# EAGLE design MoodBadge (EAGLE 9.2.2)
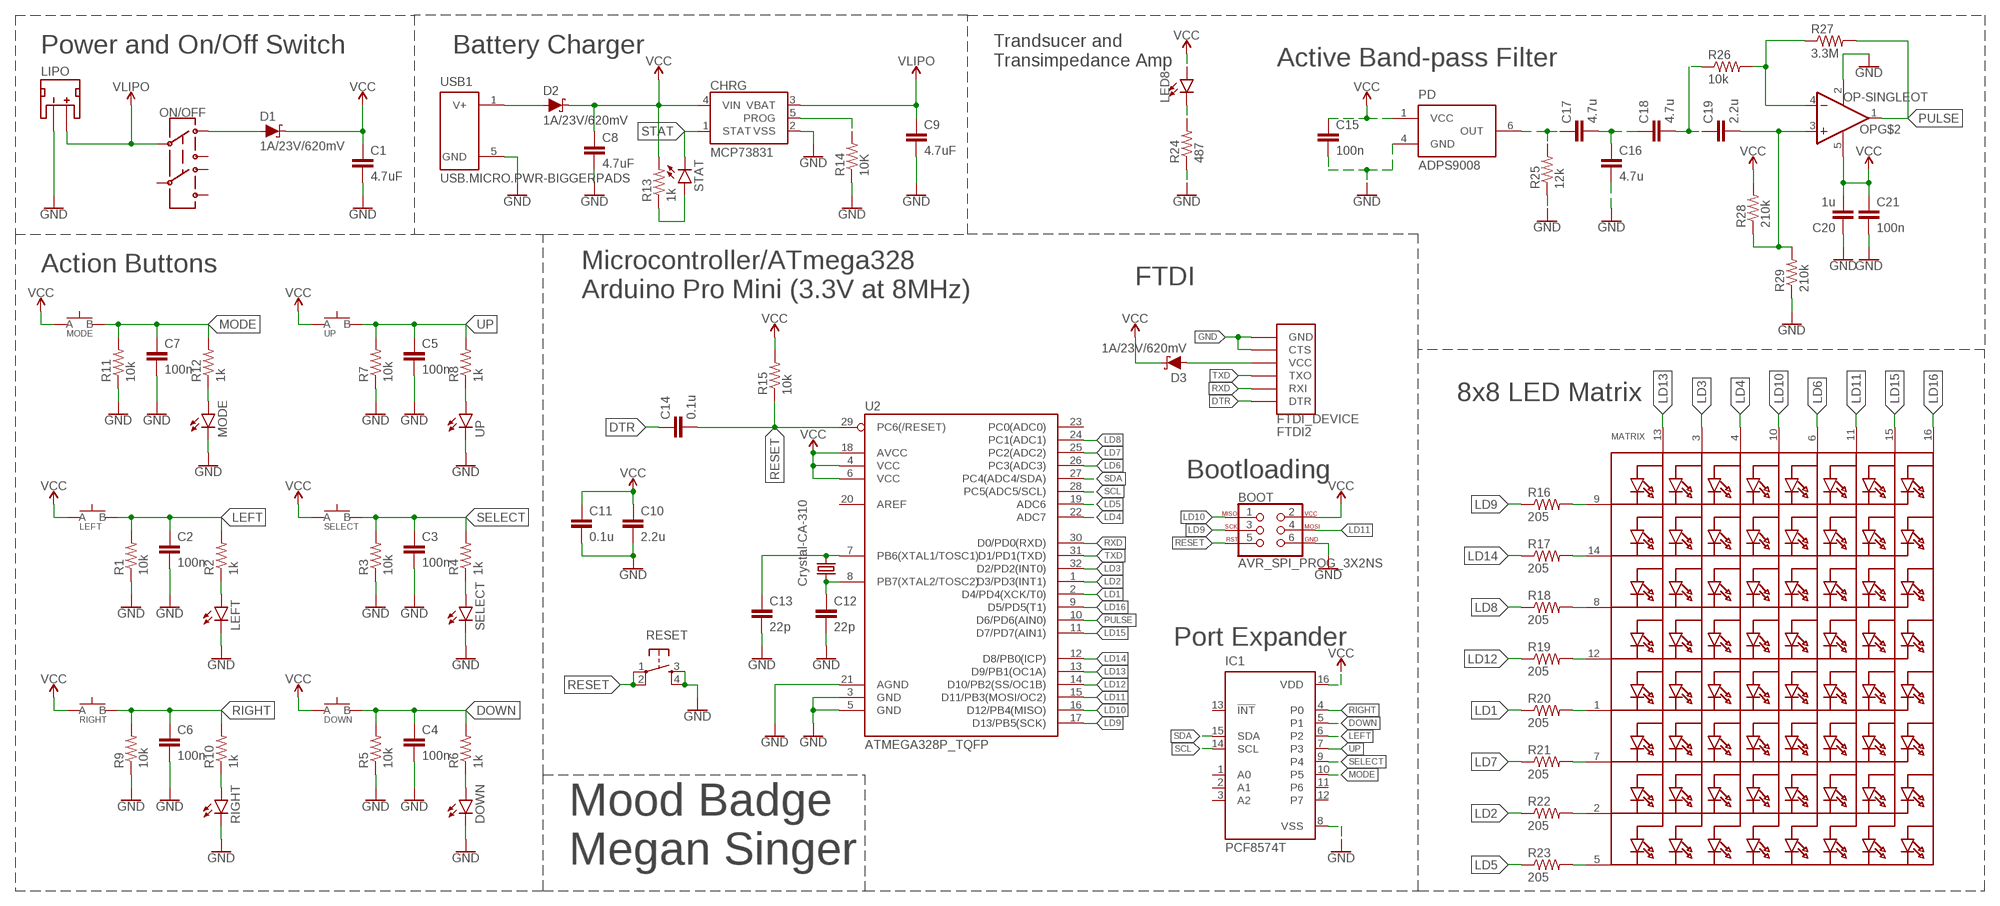
[diagram p0: schematic, sheet 1]

## Parts
BOOT  AVR_SPI_PROG_3X2NS  [2X3-NS]
C1  4.7uF  4.7UF-0603-6.3V-(10%)  [0603]
C2  100n  CAPACITOR0603  [C0603]
C3  100n  CAPACITOR0603  [C0603]
C4  100n  CAPACITOR0603  [C0603]
C5  100n  CAPACITOR0603  [C0603]
C6  100n  CAPACITOR0603  [C0603]
C7  100n  CAPACITOR0603  [C0603]
C8  4.7uF  4.7UF-0603-6.3V-(10%)  [0603]
C9  4.7uF  4.7UF-0603-6.3V-(10%)  [0603]
C10  2.2u  CAPACITOR0603  [C0603]
C11  0.1u  CAPACITOR0603  [C0603]
C12  22p  CAPACITOR0603  [C0603]
C13  22p  CAPACITOR0603  [C0603]
C14  0.1u  CAPACITOR0603  [C0603]
C15  100n  4.7UF-0603-6.3V-(10%)  [0603]
C16  4.7u  4.7UF-0603-6.3V-(10%)  [0603]
C17  4.7u  4.7UF-0603-6.3V-(10%)  [0603]
C18  4.7u  4.7UF-0603-6.3V-(10%)  [0603]
C19  2.2u  4.7UF-0603-6.3V-(10%)  [0603]
C20  1u  4.7UF-0603-6.3V-(10%)  [0603]
C21  100n  4.7UF-0603-6.3V-(10%)  [0603]
CHRG  MCP73831  [SOT23-5]
D1  1A/23V/620mV  SCHOTTKY-USC  [USC]
D2  1A/23V/620mV  SCHOTTKY-USC  [USC]
D3  1A/23V/620mV  SCHOTTKY-USC  [USC]
DOWN  SPST.KT11P4SM34LFS  [SPST.KT11P4SM34LFS]
FTDI2  FTDI_DEVICE  [FTDI_DEVICE]
IC1  PCF8574T  [SO16W]
LED1  LEFT  LED0603  [LED-0603]
LED2  SELECT  LED0603  [LED-0603]
LED3  DOWN  LED0603  [LED-0603]
LED4  UP  LED0603  [LED-0603]
LED5  RIGHT  LED0603  [LED-0603]
LED6  MODE  LED0603  [LED-0603]
LED7  STAT  LED0603  [LED-0603]
LED8  LEDZ-BEND  [2-SMD.Z-BEND]
LEFT  SPST.KT11P4SM34LFS  [SPST.KT11P4SM34LFS]
LIPO  JST_2MM_MALE  [JST-2-SMD]
MATRIX  SEGMENT_8X8_ROWCATHODEBL-M12A883  [SEGMENT_BL-M12A883]
MODE  SPST.KT11P4SM34LFS  [SPST.KT11P4SM34LFS]
ON/OFF  SWITCH.JS202011JXQNUPWARDS  [SWITCH.00]
OP  OP-SINGLEOT  [SOT23-5]
PD  ADPS9008  [6-PIN.CHIPLED]
R1  10k  RESISTOR0603  [R0603]
R2  1k  RESISTOR0603  [R0603]
R3  10k  RESISTOR0603  [R0603]
R4  1k  RESISTOR0603  [R0603]
R5  10k  RESISTOR0603  [R0603]
R6  1k  RESISTOR0603  [R0603]
R7  10k  RESISTOR0603  [R0603]
R8  1k  RESISTOR0603  [R0603]
R9  10k  RESISTOR0603  [R0603]
R10  1k  RESISTOR0603  [R0603]
R11  10k  RESISTOR0603  [R0603]
R12  1k  RESISTOR0603  [R0603]
R13  1k  RESISTOR0603  [R0603]
R14  10K  RESISTOR0603  [R0603]
R15  10k  RESISTOR0603  [R0603]
R16  205  RESISTOR0603  [R0603]
R17  205  RESISTOR0603  [R0603]
R18  205  RESISTOR0603  [R0603]
R19  205  RESISTOR0603  [R0603]
R20  205  RESISTOR0603  [R0603]
R21  205  RESISTOR0603  [R0603]
R22  205  RESISTOR0603  [R0603]
R23  205  RESISTOR0603  [R0603]
R24  487  RESISTOR0603  [R0603]
R25  12k  RESISTOR0603  [R0603]
R26  10k  RESISTOR0603  [R0603]
R27  3.3M  RESISTOR0603  [R0603]
R28  210k  RESISTOR0603  [R0603]
R29  210k  RESISTOR0603  [R0603]
RESET  SPST-PTS830GG140  [BUTTON-GULLWING]
RIGHT  SPST.KT11P4SM34LFS  [SPST.KT11P4SM34LFS]
SELECT  SPST.KT11P4SM34LFS  [SPST.KT11P4SM34LFS]
U2  ATMEGA328P_TQFP  [TQFP32-08]
UP  SPST.KT11P4SM34LFS  [SPST.KT11P4SM34LFS]
USB1  USB.MICRO.PWR-BIGGERPADS  [USB-MICRO-01.BIGGERPADS.PWR]
Y1  Crystal-CA-310  CRYSTAL-CA-310  [CA-301]

## Nets
DOWN: C4.1 DOWN.3(B) DOWN.4(B) IC1.5(P1) R5.2 R6.2
DTR: C14.1 FTDI2.DTR
GND [power]: BOOT.6 C1.2 C2.2 C3.2 C4.2 C5.2 C6.2 C7.2 C8.2 C9.2 C10.2 C11.2 C12.2 C13.2 C15.2 C16.2 C20.1 C21.2 CHRG.2(VSS) FTDI2.CTS FTDI2.GND IC1.8(VSS) LED1.C LED2.C LED3.C LED4.C LED5.C LED6.C LIPO.1(-) OP.2(V-) PD.4(GND) R1.1 R3.1 R5.1 R7.1 R9.1 R11.1 R14.1 R24.1 R25.1 R29.1 RESET.3 RESET.4 U2.3(GND) U2.5(GND) U2.21(AGND) USB1.5(GND)
LD1: R20.1 U2.2(D4/PD4(XCK/T0))
LD2: R22.1 U2.1(D3/PD3(INT1))
LD3: MATRIX.3(A2) U2.32(D2/PD2(INT0))
LD4: MATRIX.4(A3) U2.22(ADC7)
LD5: R23.1 U2.19(ADC6)
LD6: MATRIX.6(A5) U2.26(PC3(ADC3))
LD7: R21.1 U2.25(PC2(ADC2))
LD8: R18.1 U2.24(PC1(ADC1))
LD9: BOOT.3 R16.1 U2.17(D13/PB5(SCK))
LD10: BOOT.1 MATRIX.10(A4) U2.16(D12/PB4(MISO))
LD11: BOOT.4 MATRIX.11(A6) U2.15(D11/PB3(MOSI/OC2))
LD12: R19.1 U2.14(D10/PB2(SS/OC1B))
LD13: MATRIX.13(A1) U2.13(D9/PB1(OC1A))
LD14: R17.1 U2.12(D8/PB0(ICP))
LD15: MATRIX.15(A7) U2.11(D7/PD7(AIN1))
LD16: MATRIX.16(A8) U2.9(D5/PD5(T1))
LEFT: C2.1 IC1.6(P2) LEFT.3(B) LEFT.4(B) R1.2 R2.2
MODE: C7.1 IC1.10(P5) MODE.3(B) MODE.4(B) R11.2 R12.2
N$1 [power]: D2.+(A) USB1.1(V+)
N$2 [power]: D1.+(A) ON/OFF.1
N$3: LED1.A R2.1
N$4: CHRG.5(PROG) R14.2
N$5: LED2.A R4.1
N$6 [power]: LED7.A R13.1
N$7: LED3.A R6.1
N$8: C13.1 U2.7(PB6(XTAL1/TOSC1)) Y1.2
N$9: LED4.A R8.1
N$10: C12.1 U2.8(PB7(XTAL2/TOSC2)) Y1.1
N$11: LED5.A R10.1
N$12 [power]: D3.+(A) FTDI2.VCC
N$13: LED6.A R12.1
N$14: MATRIX.9(K1) R16.2
N$15: MATRIX.14(K2) R17.2
N$16: MATRIX.8(K3) R18.2
N$17: MATRIX.12(K4) R19.2
N$18: MATRIX.1(K5) R20.2
N$19: MATRIX.7(K6) R21.2
N$20: MATRIX.2(K7) R22.2
N$21: MATRIX.5(K8) R23.2
N$22: LED8.-(C) R24.2
N$23: C17.1 PD.6(OUT) R25.2
N$24: C16.1 C17.2 C18.1
N$25: C19.2 OP.3(+IN) R28.1 R29.2
N$26: C18.2 C19.1 R26.1
N$28: OP.4(-IN) R26.2 R27.1
PULSE: OP.1(OUT) R27.2 U2.10(D6/PD6(AIN0))
RESET: BOOT.5 C14.2 R15.1 RESET.1 RESET.2 U2.29(PC6(/RESET))
RIGHT: C6.1 IC1.4(P0) R9.2 R10.2 RIGHT.3(B) RIGHT.4(B)
RXD: FTDI2.TXO(RXI) U2.30(D0/PD0(RXD))
SCL: IC1.14(SCL) U2.28(PC5(ADC5/SCL))
SDA: IC1.15(SDA) U2.27(PC4(ADC4/SDA))
SELECT: C3.1 IC1.9(P4) R3.2 R4.2 SELECT.3(B) SELECT.4(B)
STAT: CHRG.1(STAT) LED7.C
TXD: FTDI2.RXI(TXO) U2.31(D1/PD1(TXD))
UP: C5.1 IC1.7(P3) R7.2 R8.2 UP.3(B) UP.4(B)
VCC [power]: BOOT.2 C8.1 C10.1 C11.1 C15.1 C20.2 C21.1 CHRG.4(VIN) D2.-(C) D3.-(C) DOWN.1(A) DOWN.2(A) IC1.16(VDD) LED8.+(A) LEFT.1(A) LEFT.2(A) MODE.1(A) MODE.2(A) OP.5(V+) PD.1(VCC) R13.2 R15.2 R28.2 RIGHT.1(A) RIGHT.2(A) SELECT.1(A) SELECT.2(A) U2.4(VCC) U2.6(VCC) U2.18(AVCC) UP.1(A) UP.2(A)
VLIPO [power]: C1.1 C9.1 CHRG.3(VBAT) D1.-(C) LIPO.2(+) ON/OFF.2 ; supply symbol labelled VCC
Unconnected: IC1.1(A0) IC1.2(A1) IC1.3(A2) IC1.11(P6) IC1.12(P7) IC1.13(!INT) LIPO.NC1(PAD1) LIPO.NC2(PAD2) ON/OFF.3 ON/OFF.5 ON/OFF.6 ON/OFF.7 U2.20(AREF) U2.23(PC0(ADC0))

## Notes on the sheet
- Power and On/Off Switch | Battery Charger
- Trandsucer and 
  Transimpedance Amp
- Active Band-pass Filter
- Action Buttons
- FTDI
- Microcontroller/ATmega328
  Arduino Pro Mini (3.3V at 8MHz)
- 8x8 LED Matrix
- Bootloading
- Port Expander
- Mood Badge
  Megan Singer

## Library data of the parts
BOOT = LinnesLab-Connectors:AVR_SPI_PROG_3X2: AVR ISP 6 Pin This is the reduced ISP connector for AVR programming. Common on Arduino. This footprint will take up less PCB space and can be used with a 10-pin to 6-pin adapter such as SKU: BOB-08508 **Special note about "TEST_POINT" package. The stop mask is on the top side, so if you want your programming test points to be on the bottom of your board, make sure to place this package on the bottom side of the board. This also ensure that the orientation to program from the bottom side will be correct. SparkFun Products: SparkFun ISP Pogo Adapter <https://www.sparkfun.com/products/11591> - NS Tiny AVR Programmer <https://www.sparkfun.com/products/11801> -PTH
C1 C8 C9 = SparkFun-Capacitors:4.7UF: 4.7µF ceramic capacitors A capacitor is a passive two-terminal electrical component used to store electrical energy temporarily in an electric field.; PROD_ID: CAP-08280
C2-C7 C10-C14 = LinnesLab-Passives:CAPACITOR
C15-C21 = SparkFun-Capacitors:4.7UF: 4.7µF ceramic capacitors A capacitor is a passive two-terminal electrical component used to store electrical energy temporarily in an electric field.; PROD_ID: CAP-08280; VALUE: 4.7uF
CHRG = SparkFun-IC-Power:MCP73831: MCP73831T Li-Ion, Li-Pol Controller Miniature single cell, fully integrated Li-Ion, Li-polymer charge management controller Datasheet <http://ww1.microchip.com/downloads/en/DeviceDoc/20001984g.pdf> SparkFun Products: SparkFun ESP32 Thing <https://www.sparkfun.com/products/13907> SparkFun 9DoF Razor IMU M0 <https://www.sparkfun.com/products/14001>; PROD_ID: IC-09995
D1-D3 = LinnesLab-DiscreteSemi:SCHOTTKY: Schottky diode A Schottky diode is a semiconductor diode which has a low forward voltage drop and a very fast switching action. Example: Digi-Key Part Number: RB161MM-20CT-ND
DOWN LEFT MODE RIGHT SELECT UP = LinnesLab-Switches:SPST.KT11P4SM34LFS: https://www.ckswitches.com/media/1468/kt.pdf
FTDI2 = LinnesLab-Connectors:FTDI_DEVICE
IC1 = micro-philips:PCF8574: I2C-Bus Remote 8-bit I/O expander http://www.semiconductors.philips.com/acrobat_download/datasheets/PCF8574_4.pdf; MPN: PCF8574T/3,512; OC_FARNELL: 1201255; OC_NEWARK: 70R6870
LED1-LED8 = LinnesLab-LED:LED: LED (Generic) Standard schematic elements and footprints for 5mm, 3mm, 1206, and 0603 sized LEDs. Generic LEDs with no color specified. LTST-C190KGKT: arrow indicates cathode
LIPO = LinnesLab-Connectors:JST_2MM_MALE: JST 2MM MALE RA CONNECTOR Two pin, compact surface mount connector. Commonly used as a battery input connection point. We really like the solid locking feeling and high current rating on these small connectors. We use these all the time as battery connectors. Mates to single-cell LiPo batteries. Here is the connector we sell at SparkFun: JST Right Angle Connector - White <https://www.sparkfun.com/products/8612> (PRT-08612) Datasheet <http://www.sparkfun.com/datasheets/Prototyping/Connectors/JST-Horizontal.pdf> It was used on these SparkFun products: SparkFun MOSFET Power Controller <https://www.sparkfun.com/products/11214> (PRT-11214) SparkFun Battery Babysitter - LiPo Battery Manager <https://www.sparkfun.com/products/13777> (PRT-13777) And many, many others that required a lipo battery connection.; PROD_ID: CONN-11443; SF_ID: PRT-08612
MATRIX = adafruit:SEGMENT_8X8_ROWCATHODE: 8x8 LED Segment Displays: Row = Cathode 0.7" Red 8X8 Matrix, 1.9mm Round LEDs - BL-M07C881UR 1.2" Red 8x8 Matrix, 3.0mm Round LEDs - BL-M12A881UR 1.2" Red 8x8 Matrix, 3.0mm Square LEDs - BL-M12A883
ON/OFF = LinnesLab-Switches:SWITCH.JS202011JXQN: Manufacturer's Part Numer: JS202011JAQN for right angle throw JS202011JCQN for top side throw
OP = LinnesLab-AnalogIC:OP-SINGLE: Single Op Amp 2.7V to 6.0V Single Supply CMOS Source: http://ww1.microchip.com/downloads/en/DeviceDoc/21314g.pdf
PD = LinnesLab-Sensors:ADPS9008
R1-R29 = LinnesLab-Passives:RESISTOR
RESET = LinnesLab-Switches:SPST-PTS830GG140
U2 = LinnesLab-Microcontrollers:ATMEGA328P_TQFP: Popular 328P in QFP Storefront component: ATmega328 - TQFP <https://www.sparkfun.com/products/13448> (COM-13448) Datasheet <http://www.sparkfun.com/datasheets/Components/SMD/ATMega328.pdf> SparkFun Products SparkFun RedBoard - Programmed with Arduino <https://www.sparkfun.com/products/12757> (DEV-12757) Arduino Pro Mini 328 - 5V/16MHz <https://www.sparkfun.com/products/11113> (DEV-11113) Arduino Pro Mini 328 - 3.3V/8MHz <https://www.sparkfun.com/products/11114> (DEV-11114) SparkFun OpenLog <https://www.sparkfun.com/products/13712> (DEV-13712) SparkFun MicroView - OLED Arduino Module <https://www.sparkfun.com/products/12923> (DEV-12923) SparkFun Digital Sandbox <https://www.sparkfun.com/products/12651> (DEV-12651) SparkFun PicoBoard <https://www.sparkfun.com/products/11888> (WIG-11888) Arduino Fio <https://www.sparkfun.com/products/10116> (DEV-10116) LilyPad Arduino 328 Main Board <https://www.sparkfun.com/products/13342> (DEV-13342) SparkFun RedStick <https://www.sparkfun.com/products/13741> (DEV-13741) LilyPad MP3 <https://www.sparkfun.com/products/11013> (DEV-11013) LilyPad Arduino SimpleSnap <https://www.sparkfun.com/products/10941> (DEV-10941) SparkFun Stepoko <https://www.sparkfun.com/products/13899> (ROB-13899) SparkFun Geiger Counter <https://www.sparkfun.com/products/11345> (SEN-11345) SparkFun EL Sequencer <https://www.sparkfun.com/products/12781> (COM-12781) Arduino Pro 328 - 5V/16MHz <https://www.sparkfun.com/products/10915> (DEV-10915) CryptoCape <https://www.sparkfun.com/products/12773> (DEV-12773) SparkFun IR Thermometer Evaluation Board - MLX90614 <https://www.sparkfun.com/products/10740> (SEN-10740) SparkFun RedBot Mainboard <https://www.sparkfun.com/products/12097> (ROB-12097) Arduino Pro 328 - 3.3V/8MHz <https://www.sparkfun.com/products/10914> (DEV-10914) SparkFun Block for Intel® Edison - Arduino <https://www.sparkfun.com/products/13036> (DEV-13036) SparkFun Simon Says - Surface Mount Soldering Kit <https://www.sparkfun.com/products/10935> (KIT-10935) SparkFun 7-Segment Serial Display - Red <https://www.sparkfun.com/products/11441> (COM-11441) SparkFun 7-Segment Serial Display - White <https://www.sparkfun.com/products/11629> (COM-11629) SparkFun 7-Segment Serial Display - Yellow <https://www.sparkfun.com/products/11443> (COM-11443) SparkFun 7-Segment Serial Display - Kelly Green <https://www.sparkfun.com/products/11440> (COM-11440) SparkFun 7-Segment Serial Display - Blue <https://www.sparkfun.com/products/11442> (COM-11442) SparkFun OpenSegment Serial Display - 20mm (Blue) <https://www.sparkfun.com/products/11647> (COM-11647) SparkFun OpenSegment Serial Display - 20mm (Green) <https://www.sparkfun.com/products/11646> (COM-11646) SparkFun OpenSegment Serial Display - 20mm (White) <https://www.sparkfun.com/products/11648> (COM-11648) SparkFun OpenSegment Serial Display - 20mm (Red) <https://www.sparkfun.com/products/11644> (COM-11644) SparkFun OpenSegment Serial Display - 20mm (Yellow) <https://www.sparkfun.com/products/11645> (COM-11645) SparkFun OpenSegment Shield <https://www.sparkfun.com/products/13190> (DEV-13190); PROD_ID: IC-09069
USB1 = LinnesLab-Connectors:USB.MICRO.PWR
Y1 = LinnesLab-Clocks:CRYSTAL-CA-310

## Net classes
1 power: width 0.305 mm

## Board
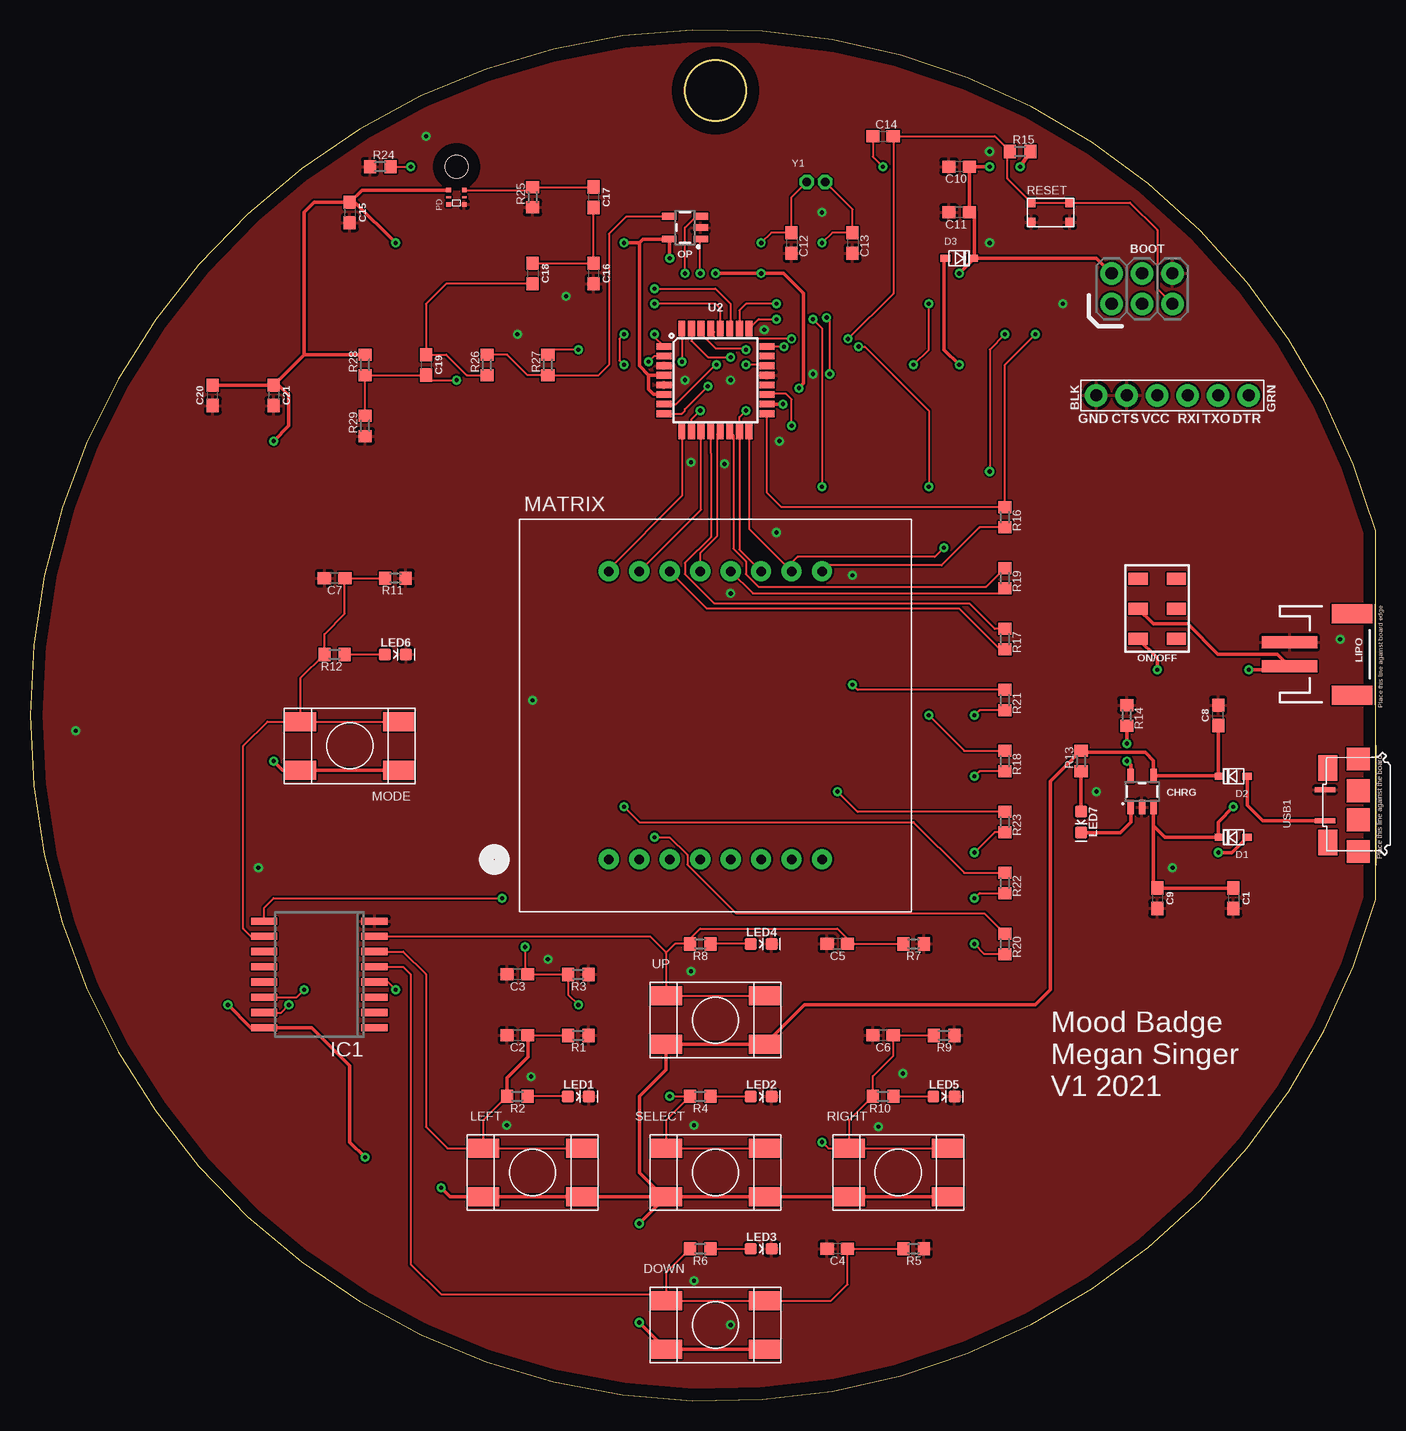
[diagram p1: board, top side]
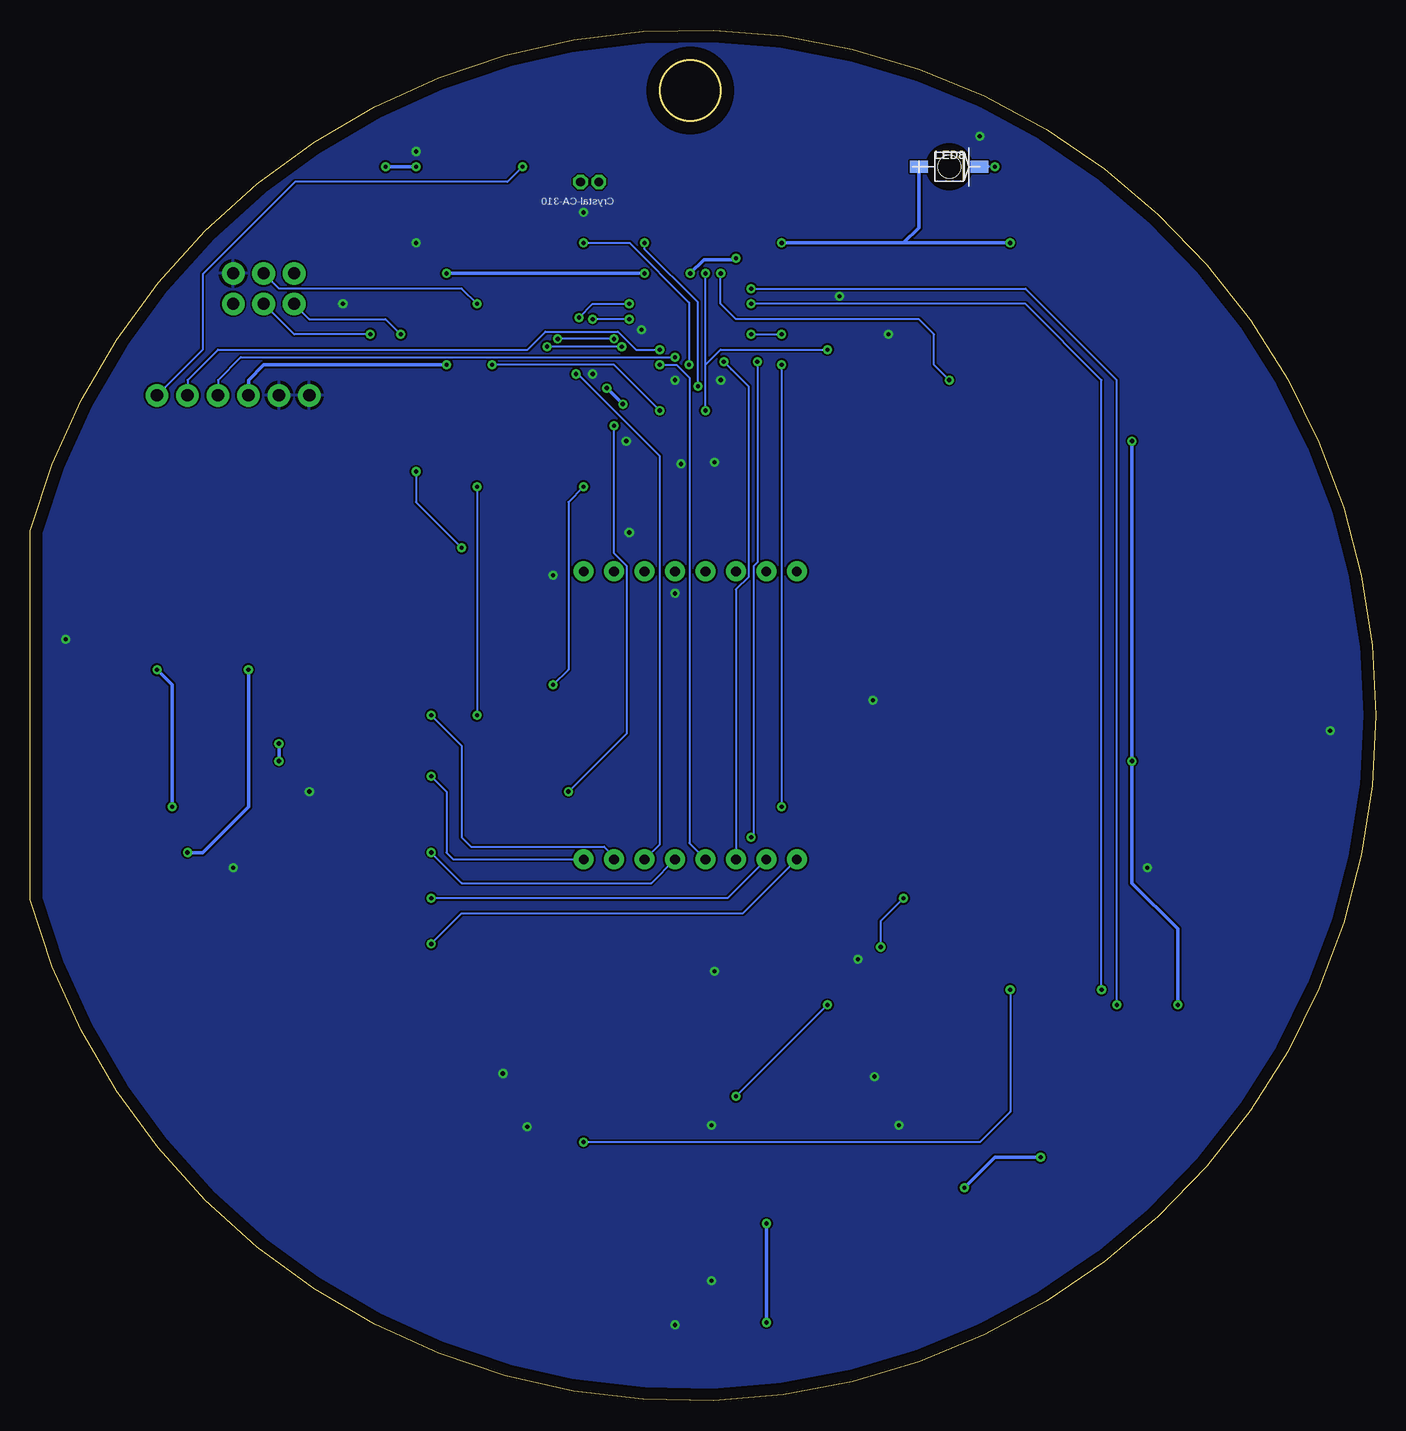
[diagram p2: board, bottom side, seen from below]

Size 112.18 x 114.23 mm. Coordinates in mm from the lower left corner, seen from the top.
Outline: 112.18,41.73 112.18,72.5 arc329 112.18,41.73
Outline: circle at 57.14,109.18 radius 2.54
Copper layers (1*16): Top 0.035mm / dielectric 1.5mm / Bottom 0.035mm
Design rules "default": minimum track width 6mil, minimum drill 0.35mm, track to track 6mil, track to pad 6mil, pad to pad 6mil, via to via 6mil, smd to smd 6mil, copper to edge 40mil, drill to drill 6mil, minimum pad ring 10mil, minimum via ring 8mil, stop-mask expansion 4mil, vias tented up to drill 0mil, thermal gap 10mil

### Footprints (pad centres in the part's own frame; a part is rotated, then mirrored left to right if it is on the bottom)
2X3-NS = drill 1.016 pad 1.88: 1 -2.54,-1.27; 2 -2.54,1.27; 3 0,-1.27; 4 0,1.27; 5 2.54,-1.27; 6 2.54,1.27
0603 = smd 1.1 x 1: 1 -0.85,0; 2 0.85,0
C0603 = smd 1.1 x 1: 1 -0.85,0; 2 0.85,0
SOT23-5 = smd 0.55 x 1.2: 1 -0.95,-1.3; 2 0,-1.3; 3 0.95,-1.3; 4 0.95,1.3; 5 -0.95,1.3
USC = smd 0.8 x 0.6: + -1.15,0; - 1.15,0
SPST.KT11P4SM34LFS = smd 2.665 x 1.59: 1 -4.128,2.02; 2 4.128,2.02; 3 -4.128,-2.02; 4 4.128,-2.02
FTDI_DEVICE = drill 1.016 pad 1.88: CTS 3.81,0; DTR -6.35,0; GND 6.35,0; RXI -1.27,0; TXO -3.81,0; VCC 1.27,0
SO16W = smd 0.6 x 2.2: 1 -4.445,-4.6; 2 -3.175,-4.6; 3 -1.905,-4.6; 4 -0.635,-4.6; 5 0.635,-4.6; 6 1.905,-4.6; 7 3.175,-4.6; 8 4.445,-4.6; 9 4.445,4.6; 10 3.175,4.6; 11 1.905,4.6; 12 0.635,4.6; 13 -0.635,4.6; 14 -1.905,4.6; 15 -3.175,4.6; 16 -4.445,4.6
LED-0603 = smd 1 x 1: A -0.877,0; C 0.877,0
2-SMD.Z-BEND = smd 1.5 x 1: + -2.525,0; - 2.525,0 | hole 1.9: 0,0
JST-2-SMD = smd 1 x 4.6: 1 -1,-3.7; 2 1,-3.7 | smd 1.6 x 3.4: NC1 -3.4,1.5; NC2 3.4,1.5
SEGMENT_BL-M12A883 = drill 0.8 pad 1.676: 1 -8.89,-12; 2 -6.35,-12; 3 -3.81,-12; 4 -1.27,-12; 5 1.27,-12; 6 3.81,-12; 7 6.35,-12; 8 8.89,-12; 9 8.89,12; 10 6.35,12; 11 3.81,12; 12 1.27,12; 13 -1.27,12; 14 -3.81,12; 15 -6.35,12; 16 -8.89,12
SWITCH.00 = smd 1 x 1.6: 1 -2.5,1.6; 2 0,1.6; 3 2.5,1.6; 5 -2.5,-1.6; 6 0,-1.6; 7 2.5,-1.6
6-PIN.CHIPLED = smd 0.4 x 0.4: 1 0.6,0.65; 3 -0.6,0.65; 4 -0.6,-0.65; 6 0.6,-0.65 | smd 0.2 x 0.4: 2 0,0.65; 5 0,-0.65
R0603 = smd 1 x 1.1: 1 -0.85,0; 2 0.85,0
BUTTON-GULLWING = smd 0.7 x 0.75: 1 -1.6,0.825; 2 1.6,0.825; 3 -1.6,-0.825; 4 1.6,-0.825
TQFP32-08 = smd 1.27 x 0.559: 1 -4.293,2.8; 2 -4.293,2; 3 -4.293,1.2; 4 -4.293,0.4; 5 -4.293,-0.4; 6 -4.293,-1.2; 7 -4.293,-2; 8 -4.293,-2.8; 17 4.293,-2.8; 18 4.293,-2; 19 4.293,-1.2; 20 4.293,-0.4; 21 4.293,0.4; 22 4.293,1.2; 23 4.293,2; 24 4.293,2.8 | smd 0.559 x 1.27: 9 -2.8,-4.293; 10 -2,-4.293; 11 -1.2,-4.293; 12 -0.4,-4.293; 13 0.4,-4.293; 14 1.2,-4.293; 15 2,-4.293; 16 2.8,-4.293; 25 2.8,4.293; 26 2,4.293; 27 1.2,4.293; 28 0.4,4.293; 29 -0.4,4.293; 30 -1.2,4.293; 31 -2,4.293; 32 -2.8,4.293
USB-MICRO-01.BIGGERPADS.PWR = smd 0.4 x 1.7: 1 -1.3,2.775; 5 1.3,2.775 | smd 1.9 x 1.9: SOLDER-1 -3.85,0; SOLDER-2 -1.2,0; SOLDER-3 1.2,0; SOLDER-4 3.85,0 | smd 2.1 x 1.6: SOLDER-5 -3.1,2.55; SOLDER-6 3.1,2.55
CA-301 = drill 0.711 octagon: 1 0,0; 2 1.524,0

### Placement (x,y rotation side)
BOOT  92.7,92.67 0 top
C1  100.32,41.87 270 top
C2  40.63,30.44 180 top
C3  40.63,35.52 180 top
C4  67.3,12.66 180 top
C5  67.3,38.06 180 top
C6  71.11,30.44 180 top
C7  25.39,68.54 180 top
C8  99.05,57.11 90 top
C9  93.97,41.87 270 top
C10  77.46,102.83 180 top
C11  77.46,99.02 180 top
C12  63.49,96.48 270 top
C13  68.57,96.48 270 top
C14  71.11,105.37 0 top
C15  26.66,99.02 270 top
C16  46.98,93.94 270 top
C17  46.98,100.29 270 top
C18  41.9,93.94 270 top
C19  33.01,86.32 270 top
C20  15.23,83.78 90 top
C21  20.31,83.78 270 top
CHRG  92.7,50.76 0 top
D1  100.32,46.95 180 top
D2  100.32,52.03 180 top
D3  77.46,95.21 0 top
DOWN  57.14,6.31 180 top
FTDI2  95.24,83.78 180 top
IC1  24.12,35.52 90 top
LED1  45.71,25.36 0 top
LED2  60.95,25.36 0 top
LED3  60.95,12.66 0 top
LED4  60.95,38.06 0 top
LED5  76.19,25.36 0 top
LED6  30.47,62.19 0 top
LED7  87.62,48.22 270 top
LED8  35.55,102.83 0 bottom
LEFT  41.9,19.01 180 top
LIPO  108.7,62.19 270 top
MATRIX  57.14,57.11 0 top
MODE  26.66,54.57 180 top
ON/OFF  93.97,66 90 top
OP  54.6,97.75 90 top
PD  35.55,100.29 90 top
R1  45.71,30.44 180 top
R2  40.63,25.36 180 top
R3  45.71,35.52 180 top
R4  55.87,25.36 180 top
R5  73.65,12.66 180 top
R6  55.87,12.66 180 top
R7  73.65,38.06 180 top
R8  55.87,38.06 180 top
R9  76.19,30.44 180 top
R10  71.11,25.36 180 top
R11  30.47,68.54 180 top
R12  25.39,62.19 180 top
R13  87.62,53.3 90 top
R14  91.43,57.11 270 top
R15  82.54,104.1 0 top
R16  81.27,73.62 270 top
R17  81.27,63.46 270 top
R18  81.27,53.3 270 top
R19  81.27,68.54 270 top
R20  81.27,38.06 270 top
R21  81.27,58.38 270 top
R22  81.27,43.14 270 top
R23  81.27,48.22 270 top
R24  29.2,102.83 0 top
R25  41.9,100.29 90 top
R26  38.09,86.32 90 top
R27  43.17,86.32 90 top
R28  27.93,86.32 90 top
R29  27.93,81.24 90 top
RESET  85.08,99.02 0 top
RIGHT  72.38,19.01 180 top
SELECT  57.14,19.01 180 top
U2  57.14,85.05 0 top
UP  57.14,31.71 180 top
USB1  110.74,49.62 90 top
Y1  64.76,101.56 0 top

### Tracks (layer width: path | path; a pad name or v marks a point on that pad's centre or on a via)
DOWN
  Top 0.152: DOWN.4 DOWN.3 66.78,8.33 68.15,9.7 C4.1 R5.2 | R6.2 53.01,10.66 DOWN.4 | IC1.5 31.11,36.16 31.74,35.52 31.74,11.39 34.28,8.85 52.49,8.85 DOWN.4
DTR  (via drill 0.35)
  Top 0.152: C14.1 70.26,103.68 v71.11,102.83
  Bottom 0.152: v71.11,102.83 72.38,101.56 90.08,101.56 97.78,93.86 97.78,87.59 FTDI2.DTR
GND  (via drill 0.35)
  other vias: 54.6,85.05 58.41,85.05 57.9,78.07 55.11,78.2 65.27,85.56 62.48,79.97 62.22,72.35 58.41,67.27 61.21,89.24 86.1,91.4 33.01,105.37 3.8,55.84 58.41,6.31 41.9,58.38 19.04,44.41 109.21,63.46 55.36,10 55.36,22.95 55.11,35.78 43.17,36.79 41.77,27.01 39.74,22.95 70.73,22.82 72.76,27.27 80,104.1 80,96.48 66.03,99.02 44.7,92.04 40.63,88.86 68.57,68.8 88.89,50.76 95.24,44.41
  pour Top: 29.2,121.88 88.89,121.88 121.91,88.86 121.91,83.78 121.91,35.52 121.91,29.17 88.89,-3.85 85.08,-7.66 34.28,-7.66 26.66,-7.66 -5.09,24.09 -7.63,26.63 -7.63,85.05
  pour Bottom: 29.2,128.23 90.16,128.23 125.72,92.67 125.72,29.17 82.54,-14.01 26.66,-14.01 24.12,-14.01 -11.44,21.55 -12.71,22.82 -12.71,83.78 -12.71,86.32
LD1  (via drill 0.35)
  Top 0.152: U2.2 52.03,87.05 v51.55,86.58 | v52.06,46.95 53.33,46.95 54.8,45.48 54.8,44.67 58.87,40.6 79.58,40.6 R20.1
  Bottom 0.152: v52.06,46.95 51.86,47.16 51.86,69.56 51.55,69.86 v51.55,86.58
LD2  (via drill 0.35)
  Top 0.152: U2.1 52.06,88.64 v52.06,88.86 | v49.52,88.86 49.14,88.48 49.14,86.7 v49.52,86.32 | v49.52,49.49 50.79,48.22 73.65,48.22 77.88,43.99 R22.1
  Bottom 0.152: v52.06,88.86 v49.52,88.86 | v49.52,86.32 v49.52,49.49
LD3  (via drill 0.35)
  Top 0.152: U2.32 v54.34,86.58
  Bottom 0.152: MATRIX.3 53.33,67.6 52.26,68.67 52.26,84.49 53.71,85.94 53.71,85.95 v54.34,86.58
LD4  (via drill 0.35)
  Top 0.152: U2.22 61.36,86.32 v59.68,86.32
  Bottom 0.152: v59.68,86.32 58.28,86.32 57.22,85.26 57.22,46.46 MATRIX.4
LD5  (via drill 0.35)
  Top 0.152: R23.1 68.99,49.07 v67.3,50.76 | U2.19 61.49,83.91 63.01,83.91 63.49,83.44 v63.49,81.24
  Bottom 0.152: v63.49,81.24 63.49,70.62 62.42,69.56 62.42,55.64 v67.3,50.76
LD6  (via drill 0.35)
  Top 0.152: v62.22,91.4 59.68,91.4 59.14,90.86 U2.26 | v66.67,85.56 66.67,90.01 v66.41,90.26
  Bottom 0.152: MATRIX.6 59.68,46.38 59.68,78.7 66.54,85.56 v66.67,85.56 | v66.41,90.26 65.27,91.4 v62.22,91.4
LD7  (via drill 0.35)
  Top 0.152: U2.25 60.73,90.13 v62.22,90.13 | R21.1 68.99,59.23 v68.57,59.65 | v65.27,90.13 66.03,89.37 66.03,85.05 v66.03,76.16
  Bottom 0.152: v66.03,76.16 67.3,74.89 67.3,60.92 v68.57,59.65 | v62.22,90.13 v65.27,90.13
LD8  (via drill 0.35)
  Top 0.152: v74.92,76.16 74.92,82.51 69.59,87.85 v69.08,87.85 | v74.92,57.11 77.88,54.15 R18.1 | U2.24 62.72,87.85 62.73,87.85 v62.84,87.85 v62.85,87.84
  Bottom 0.152: v74.92,76.16 v74.92,57.11 | v62.85,87.84 v69.07,87.84 v69.08,87.85
LD9  (via drill 0.35)
  Top 0.152: v83.81,88.86 81.27,86.32 R16.1 62.64,74.47 61.43,75.68 U2.17
  Bottom 0.152: v83.81,88.86 90.16,88.86 BOOT.3
LD10  (via drill 0.35)
  Top 0.152: U2.16 59.94,72.66 MATRIX.10 63.49,69.81 64,70.32 75.43,70.32 v76.19,71.08 | v81.27,88.86 80,87.59 v80,77.43
  Bottom 0.152: BOOT.1 88.89,90.13 82.54,90.13 v81.27,88.86 | v80,77.43 80,74.89 v76.19,71.08
LD11  (via drill 0.35)
  Top 0.152: MATRIX.11 59.14,70.92 U2.15 59.14,81.97 v59.68,82.51 | v74.92,91.4 74.92,87.59 v73.65,86.32
  Bottom 0.152: BOOT.4 91.43,92.67 76.19,92.67 v74.92,91.4 | v59.68,82.51 63.49,86.32 v73.65,86.32
LD12
  Top 0.152: U2.14 58.63,80.47 58.63,71 59.68,69.95 59.68,68.87 60.72,67.83 79.71,67.83 R19.1
LD13
  Top 0.152: U2.13 57.29,80.51 57.29,72.05 55.87,70.64 MATRIX.13
LD14
  Top 0.152: U2.12 56.74,78.98 56.76,78.96 56.76,71.97 54.6,69.81 54.6,68.87 57.04,66.44 78.3,66.44 80.42,64.31 R17.1
LD15
  Top 0.152: MATRIX.15 55.94,74.26 U2.11
LD16
  Top 0.152: MATRIX.16 48.25,69.31 54.34,75.4 U2.9
LEFT
  Top 0.152: LEFT.4 LEFT.3 | R2.2 37.77,23.36 LEFT.4 | C2.1 R1.2 | IC1.6 31.11,37.43 33.01,35.52 33.01,22.82 34.8,21.03 LEFT.4
  Top 0.305: R2.2 39.78,26.93 41.52,28.67 41.52,30.4 C2.1
MODE
  Top 0.152: R11.2 C7.1 26.24,65.58 24.54,63.88 R12.2 22.53,60.19 MODE.4 | MODE.4 MODE.3 | IC1.10 18.41,38.7 17.77,39.33 17.77,54.57 19.79,56.59 MODE.4
N$1
  Top 0.305: USB1.1 102.76,48.32 101.47,49.61 D2.+
N$2  (via drill 0.35)
  Top 0.305: ON/OFF.1 93.97,61.9 v93.97,60.92 | v99.05,45.68 100.2,45.68 D1.+
  Bottom 0.305: v93.97,60.92 93.97,49.49 97.78,45.68 v99.05,45.68
N$3
  Top 0.152: LED1.A R2.1
N$4  (via drill 0.35)
  Top 0.305: CHRG.5 91.75,52.98 v91.43,53.3 | v91.43,54.76 R14.2
  Bottom 0.305: v91.43,53.3 v91.43,54.76
N$5
  Top 0.152: R4.1 LED2.A
N$6
  Top 0.305: R13.1 LED7.A
N$7
  Top 0.152: R6.1 LED3.A
N$8  (via drill 0.35)
  Top 0.152: Y1.2 68.57,99.28 C13.1 66.88,97.33 v66.03,96.48 | U2.7 53.87,83.05 57.14,86.32 v57.24,86.32
  Bottom 0.152: v66.03,96.48 62.22,96.48 57.24,91.5 v57.24,86.32
N$9
  Top 0.152: LED4.A R8.1
N$10  (via drill 0.35)
  Top 0.152: Y1.1 63.49,100.29 C12.1 61.8,97.33 v60.95,96.48 | U2.8 54.34,82.25 54.6,82.51 54.6,82.64 v56.51,84.55
  Bottom 0.152: v56.51,84.55 56.51,91.53 60.95,95.98 v60.95,96.48
N$11
  Top 0.152: R10.1 LED5.A
N$12  (via drill 0.35)
  Top 0.305: v77.46,86.32 76.19,87.59 76.19,95.09 D3.+
  Bottom 0.305: v77.46,86.32 92.7,86.32 93.97,85.05 FTDI2.VCC
N$13
  Top 0.152: R12.1 LED6.A
N$14
  Top 0.152: R16.2 79.15,72.77 76,69.62 66.54,69.62 MATRIX.9
N$15
  Top 0.152: R17.2 80.85,62.61 77.46,66 56.44,66 MATRIX.14
N$16  (via drill 0.35)
  Top 0.152: R18.2 79.15,52.45 v78.73,52.03
  Bottom 0.152: v78.73,52.03 77.46,50.76 77.46,45.68 76.89,45.11 MATRIX.8
N$17
  Top 0.152: MATRIX.12 60.25,67.27 81.27,67.27 R19.2
N$18  (via drill 0.35)
  Top 0.152: R20.2 79.58,37.21 v78.73,38.06
  Bottom 0.152: v78.73,38.06 76.19,40.6 52.76,40.6 MATRIX.1
N$19  (via drill 0.35)
  Top 0.152: R21.2 79.15,57.53 v78.73,57.11
  Bottom 0.152: v78.73,57.11 76.19,54.57 76.19,46.95 75.42,46.18 64.32,46.18 63.49,45.35 MATRIX.7
N$20  (via drill 0.35)
  Top 0.152: v78.73,41.87 79.15,42.29 R22.2
  Bottom 0.152: MATRIX.2 54.03,41.87 v78.73,41.87
N$21  (via drill 0.35)
  Top 0.152: R23.2 80.42,47.37 v78.73,45.68
  Bottom 0.152: v78.73,45.68 76.19,43.14 60.38,43.14 MATRIX.5
N$22  (via drill 0.35)
  Top 0.152: R24.2 v31.74,102.83
  Bottom 0.152: v31.74,102.83 LED8.-
N$23
  Top 0.152: PD.6 41.65,100.89 R25.2 C17.1
N$24
  Top 0.152: C18.1 C16.1 C17.2
N$25  (via drill 0.35)
  Top 0.152: R29.2 R28.1 C19.2 33.43,85.05 v35.55,85.05 | v54.6,93.94 54.6,97.75 55.55,98.7 OP.3
  Bottom 0.152: v35.55,85.05 36.82,86.32 36.82,88.86 38.09,90.13 53.33,90.13 54.6,91.4 v54.6,93.94
N$26
  Top 0.152: R26.1 36.4,85.47 34.7,87.17 C19.1 33.01,91.4 34.7,93.09 C18.2
N$28
  Top 0.152: R26.2 39.78,87.17 41.48,85.47 R27.1 47.4,85.47 48.25,86.32 48.25,97.25 49.71,98.7 OP.4
PULSE  (via drill 0.35)
  Top 0.152: v55.87,93.94 55.87,96.77 OP.1 | v45.71,87.59 43.59,87.59 R27.2 | v55.87,82.51 55.14,81.78 U2.10
  Bottom 0.152: v55.87,82.51 55.87,86.32 | 55.87,86.32 v55.87,93.94 | 55.87,86.32 54.6,87.59 v45.71,87.59
RESET  (via drill 0.35)
  Top 0.152: 81.48,104.31 80.42,105.37 C14.2 71.96,92.25 v68.19,88.48 | 81.48,104.31 R15.1 | 81.48,104.31 81.48,101.85 RESET.1 RESET.2 91.7,99.85 93.97,97.58 93.97,92.67 BOOT.5 | U2.29 57.03,89.05 57.03,88.62 57.17,88.48 v63.49,88.48
  Bottom 0.152: v63.49,88.48 v68.19,88.48
RIGHT  (via drill 0.35)
  Top 0.152: RIGHT.4 RIGHT.3 | RIGHT.4 68.25,23.36 R10.2 70.26,27.05 71.96,28.75 C6.1 R9.2 | IC1.4 29.84,34.89 v30.47,34.25 | v66.03,21.55 66.55,21.03 RIGHT.4
  Bottom 0.152: v66.03,21.55 33.01,21.55 30.47,24.09 v30.47,34.25
RXD  (via drill 0.35)
  Top 0.152: v59.68,87.59 59.61,87.67 57.18,87.67 55.99,88.86 55.87,88.86 55.87,89.28 U2.30
  Bottom 0.152: v59.68,87.59 61.67,87.59 63.17,89.09 69.2,89.09 70.7,87.59 96.51,87.59 99.05,85.05 FTDI2.TXO
SCL  (via drill 0.35)
  Top 0.152: IC1.14 22.22,33.62 v22.85,34.25 | U2.28 57.54,91 57.14,91.4 v52.06,91.4
  Bottom 0.152: v22.85,34.25 22.85,85.05 29.2,91.4 v52.06,91.4
SDA  (via drill 0.35)
  Top 0.152: IC1.15 20.95,32.35 v21.58,32.98 | v52.06,92.67 57.14,92.67 58.41,91.4 58.41,89.42 U2.27
  Bottom 0.152: v21.58,32.98 21.58,85.05 29.2,92.67 v52.06,92.67
SELECT  (via drill 0.35)
  Top 0.152: SELECT.3 SELECT.4 53.01,23.36 R4.2 v53.33,25.36 | v45.71,32.98 44.86,33.83 R3.2 C3.1 41.27,35.74 v41.27,37.81 | IC1.9 19.52,41.08 20.31,41.87 v39.36,41.87
  Bottom 0.152: v45.71,32.98 v53.33,25.36 | v39.36,41.87 41.27,39.97 v41.27,37.81
STAT
  Top 0.305: LED7.C 90.9,47.35 91.75,48.19 CHRG.1
TXD  (via drill 0.35)
  Top 0.152: U2.31 55.14,88.32 56.51,86.96 v58.41,86.96
  Bottom 0.152: v58.41,86.96 94.61,86.96 96.51,85.05 FTDI2.RXI
UP
  Top 0.152: UP.3 UP.4 53.01,37.33 | 53.01,37.33 53.75,38.06 R8.2 55.02,38.48 55.87,39.33 67.3,39.33 68.57,38.06 | 53.01,37.33 53.01,37.37 51.68,38.7 IC1.7 | C5.1 68.57,38.06 | 68.57,38.06 R7.2
VCC  (via drill 0.35)
  Top 0.305: C8.1 99.05,52.15 D2.- 99.14,52.06 CHRG.4 93.65,53.33 92.96,54.03 87.75,54.03 R13.2 85.08,51.61 85.08,34.25 83.81,32.98 64.56,32.98 UP.1 UP.2 53.01,27.59 50.79,25.36 50.79,19.01 52.81,16.99 SELECT.2 | SELECT.2 LEFT.1 LEFT.2 35.03,16.99 v34.28,17.74 | SELECT.2 SELECT.1 RIGHT.2 RIGHT.1 | DOWN.1 DOWN.2 v50.79,6.52 | MODE.1 MODE.2 21.06,52.55 v20.31,53.3 | SELECT.2 v50.79,14.77 | 20.52,84.84 C21.1 C20.2 | 20.52,84.84 22.85,87.17 | 22.85,87.17 R28.2 | C15.1 27.68,100.89 PD.1 | 51.55,85.47 51.55,84.29 51.99,83.85 U2.6 | C15.1 23.7,99.87 22.85,99.02 22.85,87.17 | 50.79,96.48 51.11,96.8 OP.5 53.3,95.24 v53.33,95.21 | 50.79,96.48 50.79,86.23 51.55,85.47 | U2.4 51.57,85.45 51.55,85.47 | C15.1 27.08,99.87 v30.47,96.48 | v49.52,96.48 50.79,96.48 | v80,102.83 C10.1 C11.1 78.73,99.02 78.73,95.33 D3.- 78.73,95.21 | v82.54,102.83 R15.2 | 78.73,95.21 88.89,95.21 BOOT.2 | v27.93,20.28 26.66,21.55 26.66,27.9 23.49,31.08 IC1.16 18.41,31.08 v16.5,32.98 | v20.31,79.97 21.58,81.24 21.58,83.78 20.52,84.84 | v57.14,93.94 v60.95,93.94 62.83,93.94 64.48,92.29 64.48,84.77 v64.1,84.39 | v77.46,93.94 78.73,95.21 | v62.76,83.05 U2.18
  Bottom 0.305: v50.79,14.77 v50.79,6.52 | v30.47,96.48 39.36,96.48 | 39.36,96.48 v49.52,96.48 | v80,102.83 v82.54,102.83 | v34.28,17.74 31.74,20.28 v27.93,20.28 | v20.31,79.97 v20.31,53.3 20.31,43.14 16.5,39.33 v16.5,32.98 | v53.33,95.21 53.46,95.09 56,95.09 v57.14,93.94 | v60.95,93.94 v77.46,93.94 | v64.1,84.39 v62.76,83.05 | LED8.+ 38.09,102.82 38.09,97.75 39.36,96.48
VLIPO  (via drill 0.35)
  Top 0.305: 93.65,47.9 93.65,43.04 C9.1 C1.1 | 93.65,47.9 CHRG.3 | 93.65,47.9 94.6,46.95 D1.- 99.05,47.07 99.05,48.22 v100.32,49.49 | ON/OFF.2 93.64,64.73 96.51,64.73 99.04,62.21 103.99,62.21 LIPO.2 104.73,60.92 v101.59,60.92
  Bottom 0.305: v100.32,49.49 100.32,59.65 v101.59,60.92

### Text on the board
tNames: Mood Badge / Megan Singer / V1 2021